# Altium schematic sheet dac-misc.SchDoc: DAC - Misc.
size Letter; CheckedBy: J. Brinton; CompanyName: Signal Laboratories, Inc.; DrawnBy: J. Brinton; Engineer: J. Brinton; Address1: 3479 Edison Way; Address2: Menlo Park CA 94025; Address3: +1 (877) 778-8435; Address4: siglabs.com; Revision: 3; SheetNumber: 29; SheetTotal: 49; ModifiedDate: 4/20/2018
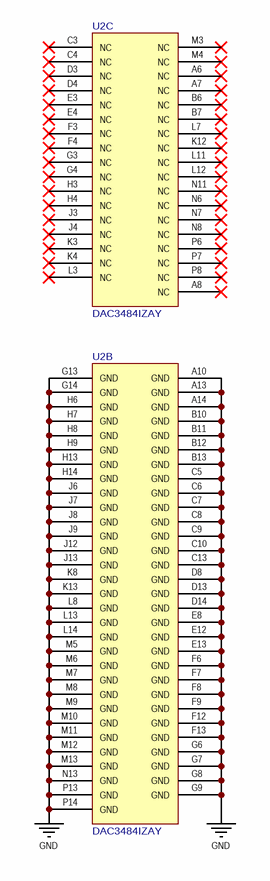
[diagram p0: dac-misc.SchDoc]

## Parts
U2  DAC3484IZAY  [ZAY-BGA-196]  (parts B,C of 5)

## Nets
GND: U2.A10(GND) U2.A13(GND) U2.A14(GND) U2.B10(GND) U2.B11(GND) U2.B12(GND) U2.B13(GND) U2.C5(GND) U2.C6(GND) U2.C7(GND) U2.C8(GND) U2.C9(GND) U2.C10(GND) U2.C13(GND) U2.D8(GND) U2.D13(GND) U2.D14(GND) U2.E8(GND) U2.E12(GND) U2.E13(GND) U2.F6(GND) U2.F7(GND) U2.F8(GND) U2.F9(GND) U2.F12(GND) U2.F13(GND) U2.G6(GND) U2.G7(GND) U2.G8(GND) U2.G9(GND) U2.G13(GND) U2.G14(GND) U2.H6(GND) U2.H7(GND) U2.H8(GND) U2.H9(GND) U2.H13(GND) U2.H14(GND) U2.J6(GND) U2.J7(GND) U2.J8(GND) U2.J9(GND) U2.J12(GND) U2.J13(GND) U2.K8(GND) U2.K13(GND) U2.L8(GND) U2.L13(GND) U2.L14(GND) U2.M5(GND) U2.M6(GND) U2.M7(GND) U2.M8(GND) U2.M9(GND) U2.M10(GND) U2.M11(GND) U2.M12(GND) U2.M13(GND) U2.N13(GND) U2.P13(GND) U2.P14(GND)

Not connected (* = marked no-connect by the designer): U2 A6(NC)* A7(NC)* A8(NC)* B6(NC)* B7(NC)* C3(NC)* C4(NC)* D3(NC)* D4(NC)* E3(NC)* E4(NC)* F3(NC)* F4(NC)* G3(NC)* G4(NC)* H3(NC)* H4(NC)* J3(NC)* J4(NC)* K3(NC)* K4(NC)* K12(NC)* L3(NC)* L7(NC)* L11(NC)* L12(NC)* M3(NC)* M4(NC)* N6(NC)* N7(NC)* N8(NC)* N11(NC)* P6(NC)* P7(NC)* P8(NC)*

## Notes on the sheet
- Title
- Engineer
- Revision
- Drawn By
- Checked By
- Date
- Sheet
- of

## Library data of the parts
U2 = DAC3484IZAY: High Speed Quad DAC, 16-bit, 1.25GSPS; Manufacturer: Texas Instruments; Manufacturer P/N: DAC3484IZAY